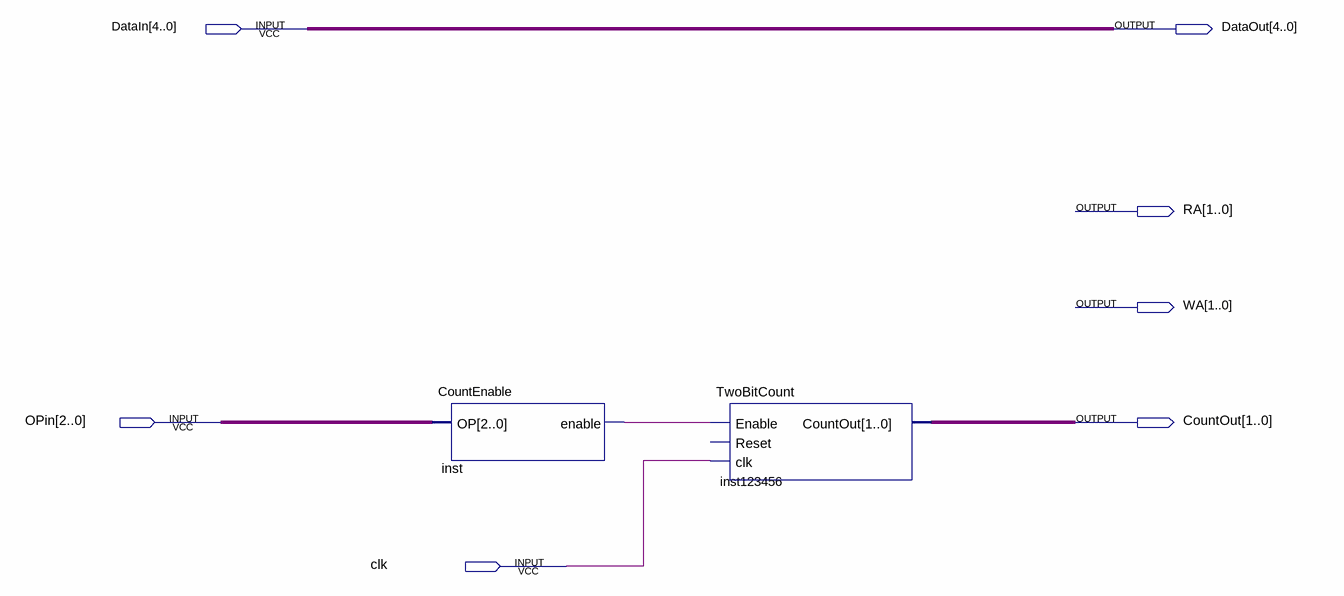
[diagram p0: schematic sheet]
// Quartus schematic StateMasheen.bdf as structural Verilog: 2 symbols, 7 pins
module StateMasheen (
  input  [4:0] DataIn,
  input  [2:0] OPin,
  input  clk,
  output [4:0] DataOut,
  output [1:0] RA,
  output [1:0] WA,
  output [1:0] CountOut
);

  wire inst_enable;

  CountEnable inst (.OP(OPin), .enable(inst_enable));
  TwoBitCount inst123456 (.Enable(inst_enable), .clk(clk), .CountOut(CountOut));  // open: Reset

  assign DataOut = DataIn;
endmodule
